# Altium project greetBot.PrjPcb
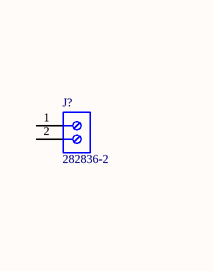
[diagram p0: main_board_schem.SchDoc, left]
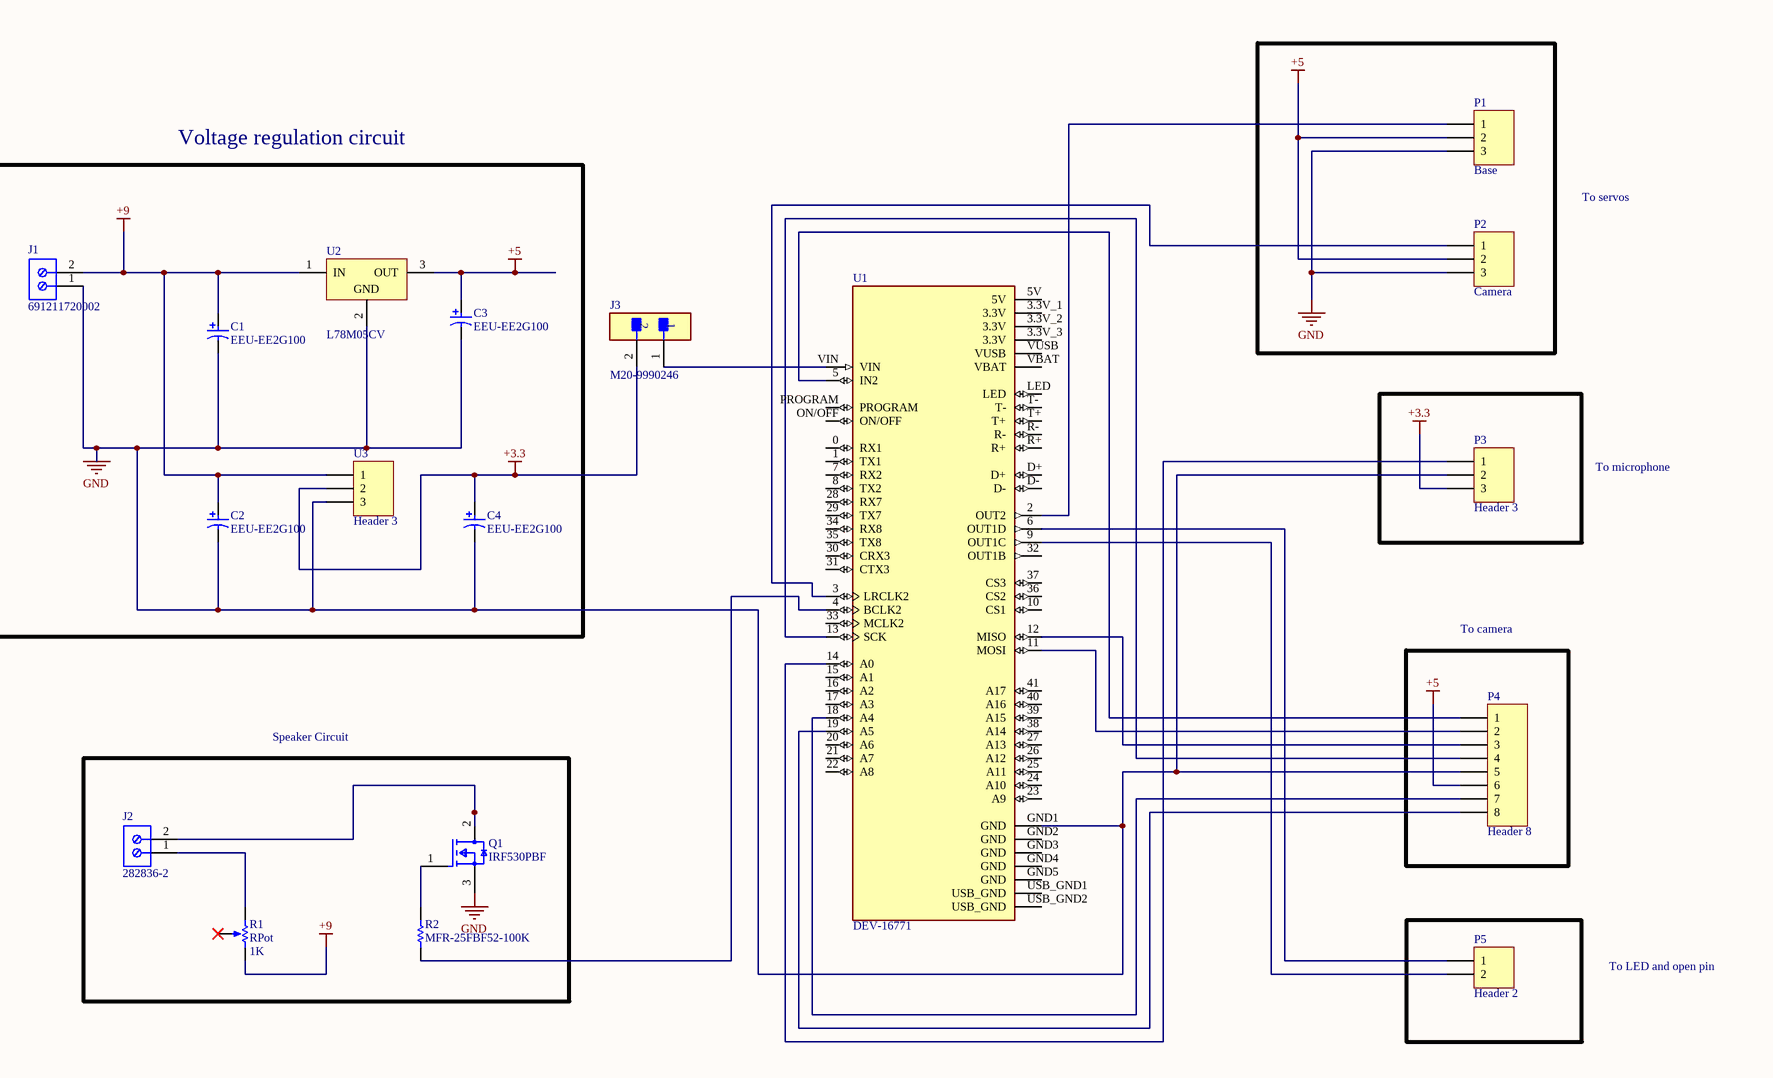
[diagram p1: main_board_schem.SchDoc, right]
1 sheet, 19 parts. Net scope: global (net labels, ports and power ports of the same name join across sheets).
Board file: main_board_layout.PcbDoc

## Sheet main_board_schem.SchDoc
size Tabloid; SheetNumber: 1; SheetTotal: 1

### Parts
C1  EEU-EE2G100  [PNSC-EEU-EE2G100-2_V]
C2  EEU-EE2G100  [PNSC-EEU-EE2G100-2_V]
C3  EEU-EE2G100  [PNSC-EEU-EE2G100-2_V]
C4  EEU-EE2G100  [PNSC-EEU-EE2G100-2_V]
J1  691211720002  [691211720002]
J2  282836-2  [TECO-282836-2_V]
J3  M20-9990246  [FP-M20-9990246-MFG]
J?  282836-2  [TECO-282836-2_V]
P1  Base  [HDR1X3]
P2  Camera  [HDR1X3]
P3  Header 3  [HDR1X3]
P4  Header 8  [HDR1X8]
P5  Header 2  [HDR1X2]
Q1  IRF530PBF  [FP-X15-0364-MFG]
R1  RPot  value 1K  [VR5]
R2  MFR-25FBF52-100K  [RESA60-630X240]
U1  DEV-16771  [MODULE_DEV-16771]
U2  L78M05CV  [TO220]
U3  Header 3  [HDR1X3]

### Blocks framed on the sheet
Voltage regulation circuit: C1-C4 J1 U2 U3
To camera: P4
Speaker Circuit: J2 Q1 R1 R2

### Nets
+3.3: C4.1 J3.2 P3.3 U3.2
+5: C3.1 P1.2 P2.2 P4.6 U2.3(OUT)
+9: C1.1 C2.1 J1.2 R1.2(BOT) U2.1(IN) U3.1
GND: C1.2 C2.2 C3.2 C4.2 J1.1 P1.3 P2.3 P3.2 P4.5 Q1.3(S) U1.GND1(GND) U2.2(GND) U3.3
NetJ2_1: J2.1 R1.1(TOP)
NetJ2_2: J2.2 Q1.2(D)
NetJ3_1: J3.1 U1.VIN
NetP1_1: P1.1 U1.2(OUT2)
NetP2_1: P2.1 U1.3(LRCLK2)
NetP3_1: P3.1 U1.14(A0)
NetP4_1: P4.1 U1.5(IN2)
NetP4_2: P4.2 U1.11(MOSI)
NetP4_3: P4.3 U1.12(MISO)
NetP4_4: P4.4 U1.13(SCK)
NetP4_7: P4.7 U1.18(A4)
NetP4_8: P4.8 U1.19(A5)
NetP5_1: P5.1 U1.6(OUT1D)
NetP5_2: P5.2 U1.9(OUT1C)
NetQ1_1: Q1.1(G) R2.2
NetR2_1: R2.1 U1.4(BCLK2)

Not connected (* = marked no-connect by the designer): J? 1 2; R1 3(TAP)*; U1 0(RX1) 1(TX1) 3.3V_1(3.3V) 3.3V_2(3.3V) 3.3V_3(3.3V) 5V 7(RX2) 8(TX2) 10(CS1) 15(A1) 16(A2) 17(A3) 20(A6) 21(A7) 22(A8) 23(A9) 24(A10) 25(A11) 26(A12) 27(A13) 28(RX7) 29(TX7) 30(CRX3) 31(CTX3) 32(OUT1B) 33(MCLK2) 34(RX8) 35(TX8) 36(CS2) 37(CS3) 38(A14) 39(A15) 40(A16) 41(A17) D+ D- GND2(GND) GND3(GND) GND4(GND) GND5(GND) LED ON/OFF PROGRAM R+ R- T+ T- USB_GND1(USB_GND) USB_GND2(USB_GND) VBAT VUSB

### Notes on the sheet
- To servos
- To microphone
- To LED and open pin

### Library data of the parts
C1-C4 = CMP-0736-00002-1: Aluminum Electrolytic Capacitor, 10 uF +/- 20%, 400 V, -25 to 105 degC, 2-Pin 10 x 10 x 22 mm Through-hole, RoHS, Tape and Reel; Manufacturer: Panasonic; Ripple Current: 430 mA; Rated Voltage: 400 V; Cap.: 10 uF; Capacitance Tolerance: +/- 20%; ComponentLink2URL: http://industrial.panasonic.com/www-data/pdf/ABA0000/ABA0000CE113.pdf; Mounting Technology: Through Hole; PackageVersion: Nov-12; ComponentLink3URL: http://industrial.panasonic.com/www-data/pdf/ABA0000/ABA0000PE245.pdf; ComponentLink2Description: Datasheet; PartNumber: EEU-EE2G100; DatasheetVersion: Nov-12; PackageDescription: 2-Pin Through-hole, Base 10 x 10 mm, Height 22 mm; PackageReference: EEU-EE2G100-2; ComponentLink1URL: http://industrial.panasonic.com/; Temp. Range: -25 to 105 degC; RoHS: TRUE; Packing: Tape and Reel; ComponentLink1Description: Manufacturer URL; ComponentLink3Description: Package Specification
J1 = CMP-1502-02524-1: Serie 211 - 5.00 mm 45deg Entry Modular with Rising Cage Clamp - 15.50 mm Height WR-TBL, 2 pin; Manufacturer: Wurth Elektronik; Pitch: 5.00mm; Pin Number: 2; Manufacturer URL: http://www.we-online.de; Mounting Technology: THT; Packaging: Box; Datasheet URL: http://katalog.we-online.de/em/datasheet/6912117200xx.pdf; Operating Temperature: -40to105degC; Package Reference: 691211720002; Part Number: 691211720002; Publisher: WurthElektronik
J2 J? = CMP-1684-00017-1: Female Header, Pitch 5 mm, 1 x 2 Position, Height 10 mm, Tail Length 3.5 mm, Rohs, Bulk; Manufacturer: TE Connectivity; Wire Gauge: 16-30AWG; Product Training Modules: Wire-to-BoardEurostyleTerminalBlocks; Clamp Material - Plating: Brass-NickelPlated; Voltage: 300V; Mating Orientation: HorizontalwithBoard; Current: 13.5A; Pitch: 0.197"(5.00mm); Screw Thread: M3; 3D Model: 282836-2.pdf; Other Names: 5ULV-02B / A98076; Dynamic Catalog: BuchananSeries; Number of Levels: 1; Torque - Screw: 0.68Nm(6Lb-In); Featured Product: EurostyleTerminalBlockConnectors; Positions Per Level: 2; Wire Termination: Screw-RisingCageClamp; Datasheet URL: http://www.te.com.cn/commerce/DocumentDelivery/DDEController?Action=showdoc&DocId=Catalog+Section%7F1308389_EUROSTYLE_TERMINAL_BLOCKS%7F0607%7Fpdf%7FEnglish%7FENG_CS_1308389_EUROSTYLE_TERMINAL_BLOCKS_0607.pdf%7F282836-2; Color: Green; Family: TerminalBlocks-WiretoBoard; RoHS Information: 282836-2StatementofCompliance; Standard Package: 300; Contact Material - Plating: Brass-TinPlated; Manufacturer URL: http://www.te.com; Housing Material: Polyamide(PA66),Nylon6/6; Features: Interlocking(Side); Package Description: Female Header, Pitch 5 mm, 1 x 2 Position, Height 10 mm, Tail Length 3.5 mm; Mounting Type: ThroughHole; Package Reference: THD; Packaging: Bulk; Series: Buchanan; Category: Connectors,Interconnects; Screw Material - Plating: Brass-NickelPlated
J3 = CMP-15831-000009-1: CONN HEADER VERT 2POS 2.54MM; Manufacturer: Harwin; Conn Gender: Male; Conn Orientation: Vertical; Number Of Contacts: 2; Current Rating: 3A; ComponentLink2URL: https://cdn.harwin.com/pdfs/M20-999.pdf; ComponentLink2Description: Datasheet; Package: M20-9990246; Temperature: -40°C to +105°C; Octopart: https://octopart.com/m20-9990246-harwin-2590635; Mouser Description: 2.54mm (0.1") Pitch SIL Vertical PC Tail Pin Header, 6.1mm mating pin height, tin, 2 contacts; Temperature Range High: +105°C; Device Class L1: Connectors; RoHS: TRUE; Automotive: No; Height: 8.99mm; Number Of Rows: 1; Contact Material: Tin,Nickel; Category: Conn; Pitch: 2.54mm; Lead Free: Yes; Digikey Description: CONN HEADER VERT 2POS 2.54MM; Manufacturer Part Number: M20-9990246; Temperature Range Low: -40°C; Device Class L3: unset; Device Class L2: Headers and Wire Housings
P1-P3 U3 = Header 3: Header, 3-Pin; LatestRevisionDate: 17-Jul-2002; LatestRevisionNote: Re-released for DXP Platform.; Publisher: Altium Limited
P4 = Header 8: Header, 8-Pin; LatestRevisionDate: 17-Jul-2002; LatestRevisionNote: Re-released for DXP Platform.; Publisher: Altium Limited
P5 = Header 2: Header, 2-Pin; LatestRevisionDate: 17-Jul-2002; LatestRevisionNote: Re-released for DXP Platform.; Publisher: Altium Limited
Q1 = CMP-02550-000190-1: MOSFET N-CH 100V 14A TO-220AB; Manufacturer: Vishay; Reverse Recovery Charge: 850nC; Rthja Max: 62°C/W; Power Dissipation: 88W; Depletion Mode: False; Input Capacitace At Vds: 670pF @ 25V; Pulse Drain Current: 56A; Turn On Delay Time: 10ns; Drain To Source Resistance: 0.16Ω; Number Of N Channels: 1; Max Junction Temp: +175°C; Threshold Vgs Max: 4V; Standoff Height: 3.33mm; Max Forward Diode Voltage: 2.5V; Turn Off Delay Time: 23ns; Gate To Source Voltage: 20V; Threshold Vgs Min: 2V; Reverse Recovery Time: 150ns; Gate Charge At Vgs: 26nC @ 10V; Temperature: -55°C to +175°C; Drain To Source Voltage: 100V; Mouser Description: MOSFET N-Chan 100V 14 Amp; Device Class L2: Transistors; Temperature Range High: +175°C; ComponentLink2URL: http://www.vishay.com/docs/91019/91019.pdf; Lead Free: Yes; Height: 19.89mm; Octopart: https://octopart.com/irf530pbf-vishay-46547999; Category: Trans; ComponentLink2Description: Datasheet; RoHS: TRUE; Device Class L3: MOSFETs; Automotive: No; Device Class L1: Discrete Semiconductors; Package: X15-0364; Manufacturer Part Number: IRF530PBF; Continuous Drain Current: 14A; Digikey Description: MOSFET N-CH 100V 14A TO-220AB; Number Of Channels: 1; Drain To Source Breakdown Voltage: 100V; Temperature Range Low: -55°C
R1 = RPot: Potentiometer; Sim Note: Enter the Resistance value and the set point into parameter fields.; Set Position: 0.5; Published: 8-Jun-2000; LatestRevisionDate: 17-Jul-2002; LatestRevisionNote: Re-released for DXP Platform.; PackageReference: VR5; Publisher: Altium Limited; PackageDescription: Variable Resistor, Thru-Hole; 3 Leads
R2 = CMP-1659-00073-1: Axial Resistor, 100 KOhm, +/- 1%, 0.25 W, -55 to 155 degC, 2-Pin THD, RoHS, Bulk; Voltage Rating: 250 V; Power Rating: 250 mW; Resistance: 475 Ohm; PackageDescription: 2-Pin Axial Lead, Dia 2.4 mm, Body Length 6.3 mm; PackageReference: MFR-25; Length: 0.248 inch; ComponentLink2Description: Datasheet; Packaging: Bulk; DatasheetVersion: Apr-13; Package Quantity: 200; Min Operating Temperature: -55 degC; ComponentLink2URL: http://www.yageo.com/documents/recent/Yageo%20LR_MFR_2013.pdf; RoHSCompliant: true; ComponentLink1URL: http://www.yageo.com/; Tolerance: 1%; Case\Package: Axial; Mount: Through Hole; ComponentLink1Description: Manufacturer URL; Max Operating Temperature: 155 degC
U1 = DEV-16771: RT1062 Teensy 4.1 i.MX ARM Cortex-M7 MPU Embedded Evaluation Board; Value: *; Availability: Unavailable; Price: None; MP: DEV-16771; Package: None
U2 = CMP-0244-00437-1: Positive Voltage Regulator, 5V, 3-Pin TO-220; ComponentLink1Description: Manufacturer URL; PackageReference: TO220; ComponentLink1URL: http://www.st.com; PackageVersion: ver3.0; ComponentLink3Description: Package Specification; ComponentLink2URL: http://www.st.com/internet/com/TECHNICAL_RESOURCES/TECHNICAL_LITERATURE/DATASHEET/CD00000447.pdf; PackageDescription: TO, Thru-Hole, Vertical, Heatsink Mounted; 3 In-Line Leads; Pitch 2.54 mm; DatasheetVersion: 1/11/2010; ComponentLink3URL: http://www.st.com/internet/com/TECHNICAL_RESOURCES/TECHNICAL_LITERATURE/PACKAGE_INFORMATION/CD00004649.pdf; ComponentLink2Description: Datasheet